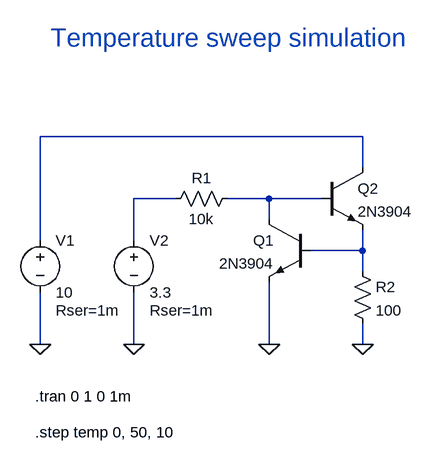
[diagram p0: schematic Temperature-sweep-simulation.asc]
Temperature-sweep-simulation.asc, the LTspice schematic file:
Version 4.1
SHEET 1 880 680
WIRE 560 32 64 32
WIRE 560 80 560 32
WIRE 272 128 208 128
WIRE 416 128 352 128
WIRE 496 128 416 128
WIRE 416 160 416 128
WIRE 64 192 64 32
WIRE 208 192 208 128
WIRE 560 208 560 176
WIRE 560 208 480 208
WIRE 560 240 560 208
WIRE 64 352 64 272
WIRE 208 352 208 272
WIRE 416 352 416 256
WIRE 560 352 560 320
FLAG 560 352 0
FLAG 416 352 0
FLAG 208 352 0
FLAG 64 352 0
SYMBOL voltage 64 176 R0
WINDOW 123 0 0 Left 0
WINDOW 39 24 124 Left 2
SYMATTR InstName V1
SYMATTR Value 10
SYMATTR SpiceLine Rser=1m
SYMBOL voltage 208 176 R0
WINDOW 123 0 0 Left 0
WINDOW 39 24 124 Left 2
SYMATTR InstName V2
SYMATTR Value 3.3
SYMATTR SpiceLine Rser=1m
SYMBOL res 256 144 R270
WINDOW 0 32 56 VTop 2
WINDOW 3 0 56 VBottom 2
SYMATTR InstName R1
SYMATTR Value 10k
SYMBOL res 544 224 R0
SYMATTR InstName R2
SYMATTR Value 100
SYMBOL npn 480 160 M0
SYMATTR InstName Q1
SYMATTR Value 2N3904
SYMBOL npn 496 80 R0
SYMATTR InstName Q2
SYMATTR Value 2N3904
TEXT 56 432 Left 2 !.tran 0 1 0 1m
TEXT 56 488 Left 2 !.step temp 0, 50, 10
TEXT 80 -120 Left 4 ;Temperature sweep simulation

The netlist it stands for:
* Temperature-sweep-simulation.asc
V1 N001 0 10 Rser=1m
V2 N002 0 3.3 Rser=1m
R1 N002 N003 10k
R2 N004 0 100
Q1 N003 N004 0 0 2N3904
Q2 N001 N003 N004 0 2N3904
.model NPN NPN
.model PNP PNP
.lib standard.bjt
.tran 0 1 0 1m
.step temp 0, 50, 10
* Temperature sweep simulation
.backanno
.end